# Altium schematic sheet Connection.SchDoc
size 381 x 279 mm; SheetNumber: 1; SheetTotal: 8
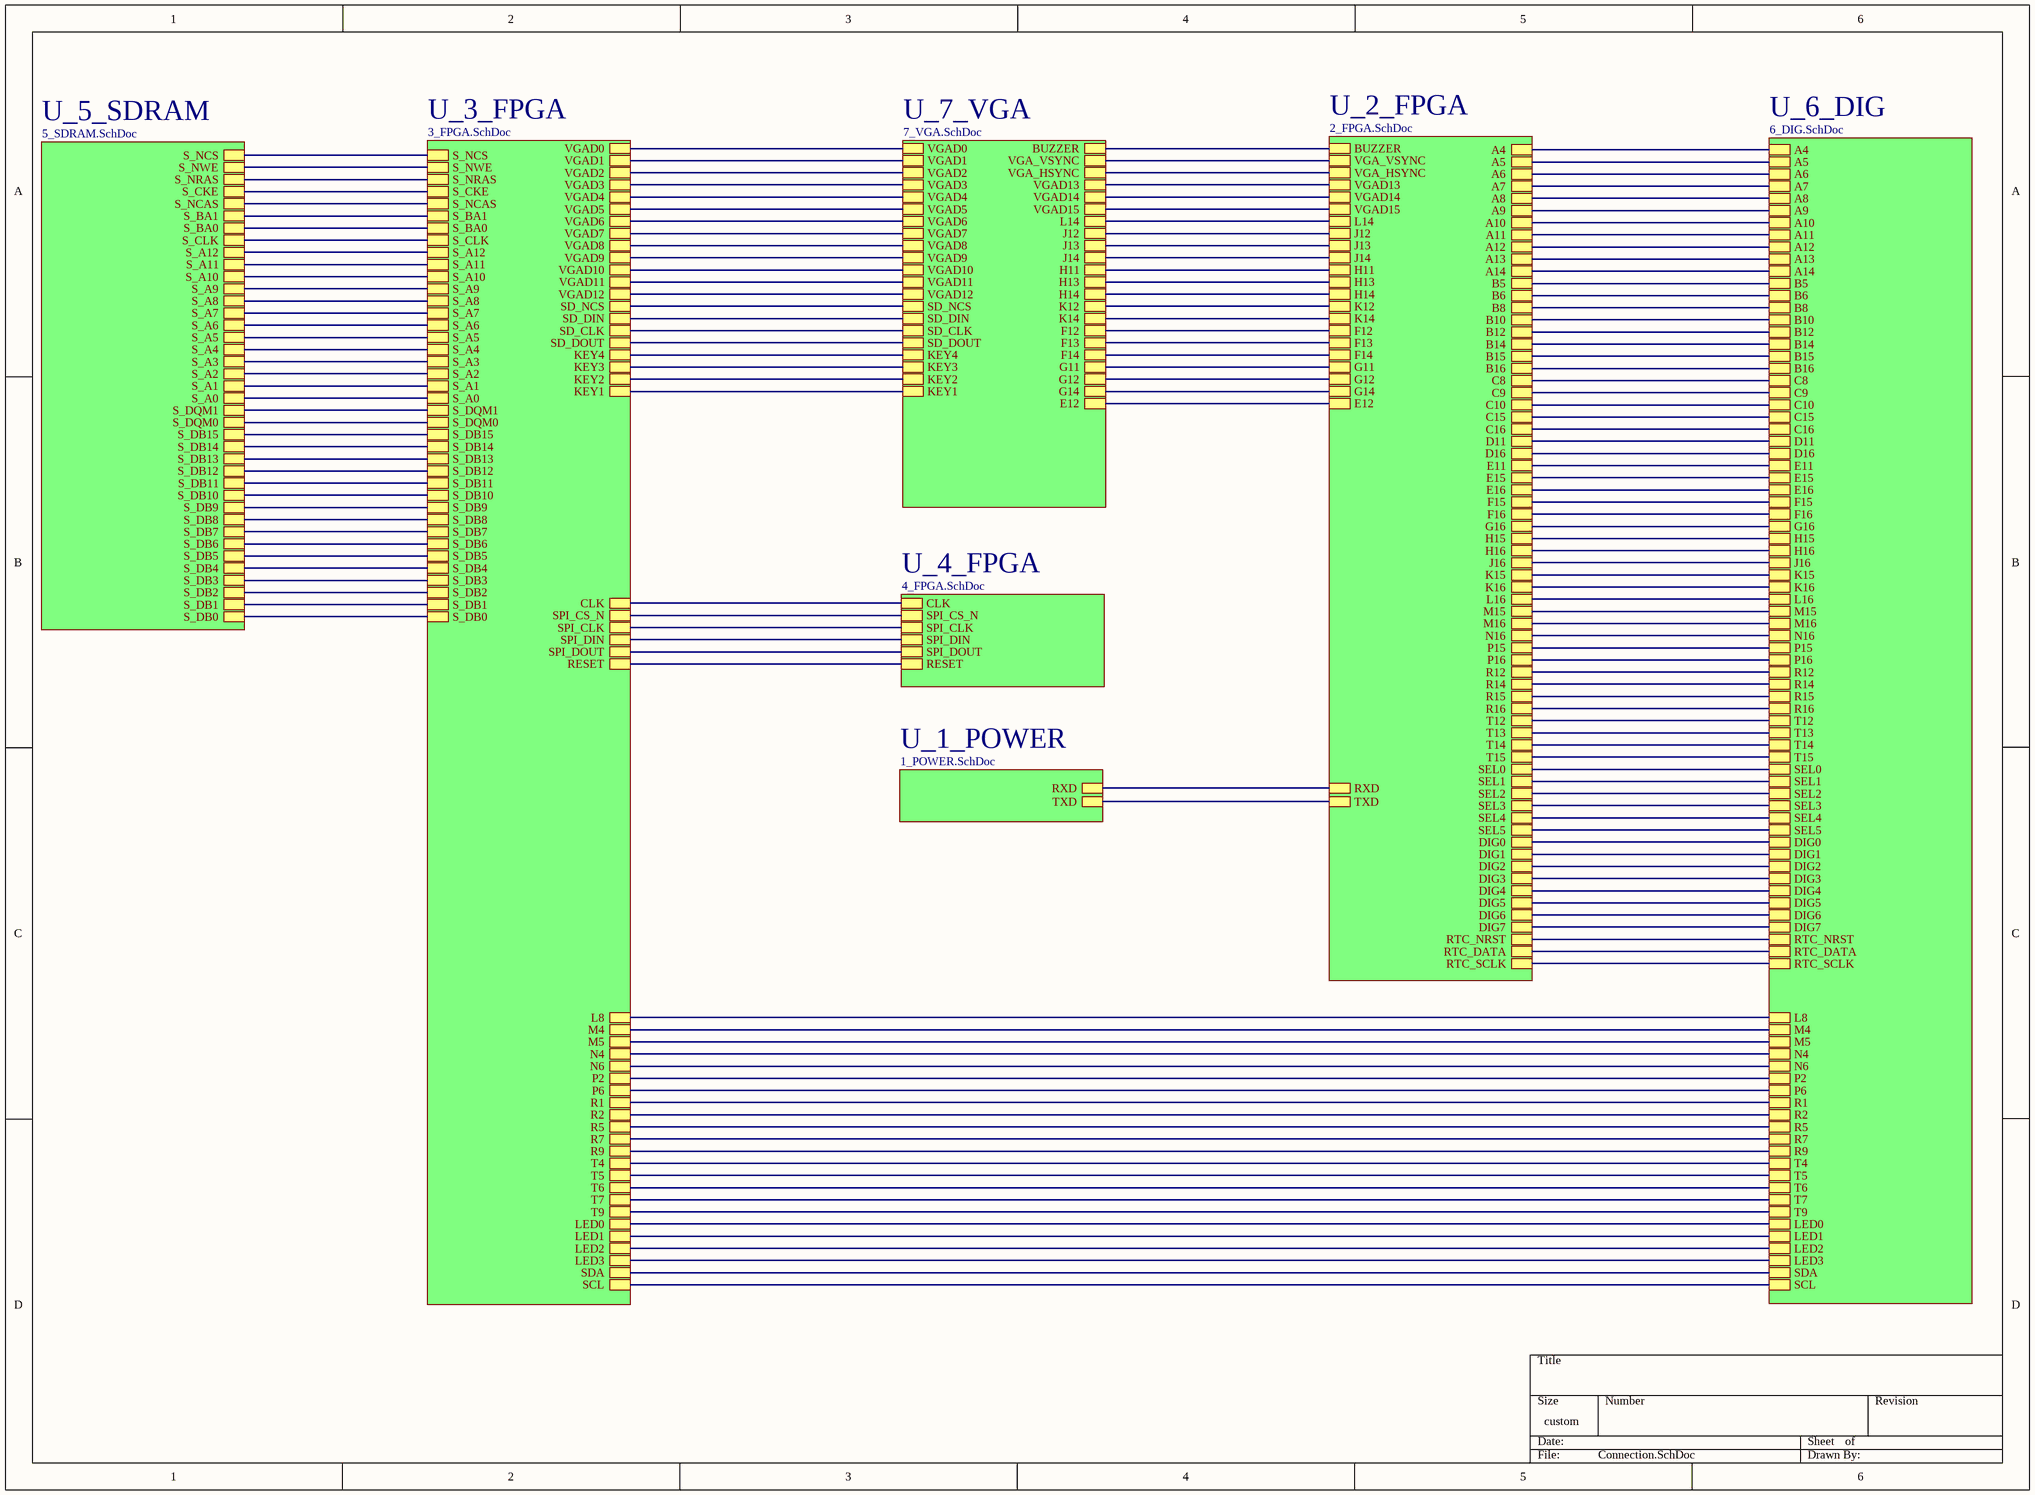
[diagram p0: Connection.SchDoc]

## Sub-sheets
U_1_POWER = 1_POWER.SchDoc: RXD, TXD
U_2_FPGA = 2_FPGA.SchDoc: RTC_SCLK, E12, B15, B16, F12, G11, RTC_DATA, D16, F13, F14, C15, C16, E15, E16, F15, F16, G14, G16, H15, H16, G12, H11, H13, H14, BUZZER, J12, J13, K14, K12, J14, J16, K15, K16, VGAD14, N16, M15, M16, L14, L16, P15, P16, R15, R16, R14, T15, T14, T13, R12, T12, VGAD13, VGA_VSYNC, VGAD15, VGA_HSYNC, A4, B5, A5, DIG6, DIG2, B6, A6, DIG3, DIG1, DIG0, A7, DIG4, DIG7, B8, A8, C9, A9, B10, A10, DIG5, SEL1, SEL4, C10, SEL0, C8, RXD, A11, SEL2, SEL5, B12, A12, RTC_NRST, A13, SEL3, E11, B14, A14, D11, TXD
U_3_FPGA = 3_FPGA.SchDoc: M4, SD_CLK, M5, N4, R2, R1, P2, S_A4, SD_NCS, S_A5, S_A6, S_A7, RESET, S_A8, S_A9, S_A11, S_A0, S_A12, S_CKE, S_DB12, S_DQM1, S_NCS, S_NCAS, S_NRAS, S_A2, S_A1, S_BA1, S_DB8, S_CLK, S_DB10, SD_DOUT, SD_DIN, S_DQM0, S_NWE, S_A3, S_A10, KEY1, S_DB5, KEY2, S_DB7, S_DB6, S_DB4, S_BA0, S_DB9, S_DB3, S_DB2, S_DB15, S_DB14, KEY3, KEY4, S_DB11, S_DB13, S_DB1, S_DB0, VGAD12, VGAD11, SPI_DOUT, SCL, SDA, VGAD10, VGAD6, VGAD7, VGAD8, VGAD9, R9, T9, VGAD5, VGAD3, VGAD2, CLK, VGAD0, VGAD1, R7, T7, P6, T6, R5, T5, LED1, LED2, L8, VGAD4, LED0, T4, LED3, N6, SPI_CS_N, SPI_CLK, SPI_DIN
U_4_FPGA = 4_FPGA.SchDoc: CLK, SPI_CS_N, SPI_CLK, SPI_DIN, SPI_DOUT, RESET
U_5_SDRAM = 5_SDRAM.SchDoc: S_DB0, S_DB1, S_DB2, S_DB3, S_DB4, S_DB5, S_DB6, S_DB7, S_DB8, S_DB9, S_DB10, S_DB11, S_DB12, S_DB13, S_DB14, S_DB15, S_DQM0, S_DQM1, S_A0, S_A1, S_A2, S_A3, S_A4, S_A5, S_A6, S_A7, S_A8, S_A9, S_A10, S_A11, S_A12, S_CLK, S_BA0, S_BA1, S_NCAS, S_CKE, S_NRAS, S_NWE, S_NCS
U_6_DIG = 6_DIG.SchDoc: A4, B5, A5, A6, A7, A8, A9, A10, A11, A12, A13, A14, B6, B8, C8, B10, B12, B14, B15, B16, C15, C16, D16, E15, E16, C9, C10, E11, D11, F15, F16, G16, H15, H16, LED0, LED1, LED2, LED3, SDA, SCL, J16, K16, K15, L16, M16, M15, N16, P16, P15, R14, R15, R16, T12, T13, T14, T15, R12, T4, T5, T6, T7, T9, L8, R9, R7, R5, R1, R2, M4, M5, N4, P6, N6, P2, DIG4, DIG1, DIG2, DIG3, DIG5, DIG6, DIG7, DIG0, SEL0, SEL1, SEL2, SEL3, SEL4, SEL5, RTC_SCLK, RTC_NRST, RTC_DATA
U_7_VGA = 7_VGA.SchDoc: VGAD15, VGAD0, VGAD1, VGAD2, VGAD3, VGAD4, VGAD5, VGAD6, VGAD7, VGAD8, VGAD9, VGAD10, VGAD11, VGAD12, VGAD13, VGAD14, L14, K14, J14, H11, G12, H14, G14, F14, K12, J13, J12, G11, H13, F12, F13, E12, BUZZER, SD_NCS, SD_DIN, SD_CLK, SD_DOUT, KEY4, KEY3, KEY2, KEY1, VGA_HSYNC, VGA_VSYNC

## Nets
(unnamed): sheet U_1_POWER/RXD, sheet U_2_FPGA/RXD
(unnamed): sheet U_1_POWER/TXD, sheet U_2_FPGA/TXD
(unnamed): sheet U_2_FPGA/RTC_SCLK, sheet U_6_DIG/RTC_SCLK
(unnamed): sheet U_2_FPGA/E12, sheet U_7_VGA/E12
(unnamed): sheet U_2_FPGA/B15, sheet U_6_DIG/B15
(unnamed): sheet U_2_FPGA/B16, sheet U_6_DIG/B16
(unnamed): sheet U_2_FPGA/F12, sheet U_7_VGA/F12
(unnamed): sheet U_2_FPGA/G11, sheet U_7_VGA/G11
(unnamed): sheet U_2_FPGA/RTC_DATA, sheet U_6_DIG/RTC_DATA
(unnamed): sheet U_2_FPGA/D16, sheet U_6_DIG/D16
(unnamed): sheet U_2_FPGA/F13, sheet U_7_VGA/F13
(unnamed): sheet U_2_FPGA/F14, sheet U_7_VGA/F14
(unnamed): sheet U_2_FPGA/C15, sheet U_6_DIG/C15
(unnamed): sheet U_2_FPGA/C16, sheet U_6_DIG/C16
(unnamed): sheet U_2_FPGA/E15, sheet U_6_DIG/E15
(unnamed): sheet U_2_FPGA/E16, sheet U_6_DIG/E16
(unnamed): sheet U_2_FPGA/F15, sheet U_6_DIG/F15
(unnamed): sheet U_2_FPGA/F16, sheet U_6_DIG/F16
(unnamed): sheet U_2_FPGA/G14, sheet U_7_VGA/G14
(unnamed): sheet U_2_FPGA/G16, sheet U_6_DIG/G16
(unnamed): sheet U_2_FPGA/H15, sheet U_6_DIG/H15
(unnamed): sheet U_2_FPGA/H16, sheet U_6_DIG/H16
(unnamed): sheet U_2_FPGA/G12, sheet U_7_VGA/G12
(unnamed): sheet U_2_FPGA/H11, sheet U_7_VGA/H11
(unnamed): sheet U_2_FPGA/H13, sheet U_7_VGA/H13
(unnamed): sheet U_2_FPGA/H14, sheet U_7_VGA/H14
(unnamed): sheet U_2_FPGA/BUZZER, sheet U_7_VGA/BUZZER
(unnamed): sheet U_2_FPGA/J12, sheet U_7_VGA/J12
(unnamed): sheet U_2_FPGA/J13, sheet U_7_VGA/J13
(unnamed): sheet U_2_FPGA/K14, sheet U_7_VGA/K14
(unnamed): sheet U_2_FPGA/K12, sheet U_7_VGA/K12
(unnamed): sheet U_2_FPGA/J14, sheet U_7_VGA/J14
(unnamed): sheet U_2_FPGA/J16, sheet U_6_DIG/J16
(unnamed): sheet U_2_FPGA/K15, sheet U_6_DIG/K15
(unnamed): sheet U_2_FPGA/K16, sheet U_6_DIG/K16
(unnamed): sheet U_2_FPGA/VGAD14, sheet U_7_VGA/VGAD14
(unnamed): sheet U_2_FPGA/N16, sheet U_6_DIG/N16
(unnamed): sheet U_2_FPGA/M15, sheet U_6_DIG/M15
(unnamed): sheet U_2_FPGA/M16, sheet U_6_DIG/M16
(unnamed): sheet U_2_FPGA/L14, sheet U_7_VGA/L14
(unnamed): sheet U_2_FPGA/L16, sheet U_6_DIG/L16
(unnamed): sheet U_2_FPGA/P15, sheet U_6_DIG/P15
(unnamed): sheet U_2_FPGA/P16, sheet U_6_DIG/P16
(unnamed): sheet U_2_FPGA/R15, sheet U_6_DIG/R15
(unnamed): sheet U_2_FPGA/R16, sheet U_6_DIG/R16
(unnamed): sheet U_2_FPGA/R14, sheet U_6_DIG/R14
(unnamed): sheet U_2_FPGA/T15, sheet U_6_DIG/T15
(unnamed): sheet U_2_FPGA/T14, sheet U_6_DIG/T14
(unnamed): sheet U_2_FPGA/T13, sheet U_6_DIG/T13
(unnamed): sheet U_2_FPGA/R12, sheet U_6_DIG/R12
(unnamed): sheet U_2_FPGA/T12, sheet U_6_DIG/T12
(unnamed): sheet U_2_FPGA/VGAD13, sheet U_7_VGA/VGAD13
(unnamed): sheet U_2_FPGA/VGA_VSYNC, sheet U_7_VGA/VGA_VSYNC
(unnamed): sheet U_2_FPGA/VGAD15, sheet U_7_VGA/VGAD15
(unnamed): sheet U_2_FPGA/VGA_HSYNC, sheet U_7_VGA/VGA_HSYNC
(unnamed): sheet U_2_FPGA/A4, sheet U_6_DIG/A4
(unnamed): sheet U_2_FPGA/B5, sheet U_6_DIG/B5
(unnamed): sheet U_2_FPGA/A5, sheet U_6_DIG/A5
(unnamed): sheet U_2_FPGA/DIG6, sheet U_6_DIG/DIG6
(unnamed): sheet U_2_FPGA/DIG2, sheet U_6_DIG/DIG2
(unnamed): sheet U_2_FPGA/B6, sheet U_6_DIG/B6
(unnamed): sheet U_2_FPGA/A6, sheet U_6_DIG/A6
(unnamed): sheet U_2_FPGA/DIG3, sheet U_6_DIG/DIG3
(unnamed): sheet U_2_FPGA/DIG1, sheet U_6_DIG/DIG1
(unnamed): sheet U_2_FPGA/DIG0, sheet U_6_DIG/DIG0
(unnamed): sheet U_2_FPGA/A7, sheet U_6_DIG/A7
(unnamed): sheet U_2_FPGA/DIG4, sheet U_6_DIG/DIG4
(unnamed): sheet U_2_FPGA/DIG7, sheet U_6_DIG/DIG7
(unnamed): sheet U_2_FPGA/B8, sheet U_6_DIG/B8
(unnamed): sheet U_2_FPGA/A8, sheet U_6_DIG/A8
(unnamed): sheet U_2_FPGA/C9, sheet U_6_DIG/C9
(unnamed): sheet U_2_FPGA/A9, sheet U_6_DIG/A9
(unnamed): sheet U_2_FPGA/B10, sheet U_6_DIG/B10
(unnamed): sheet U_2_FPGA/A10, sheet U_6_DIG/A10
(unnamed): sheet U_2_FPGA/DIG5, sheet U_6_DIG/DIG5
(unnamed): sheet U_2_FPGA/SEL1, sheet U_6_DIG/SEL1
(unnamed): sheet U_2_FPGA/SEL4, sheet U_6_DIG/SEL4
(unnamed): sheet U_2_FPGA/C10, sheet U_6_DIG/C10
(unnamed): sheet U_2_FPGA/SEL0, sheet U_6_DIG/SEL0
(unnamed): sheet U_2_FPGA/C8, sheet U_6_DIG/C8
(unnamed): sheet U_2_FPGA/A11, sheet U_6_DIG/A11
(unnamed): sheet U_2_FPGA/SEL2, sheet U_6_DIG/SEL2
(unnamed): sheet U_2_FPGA/SEL5, sheet U_6_DIG/SEL5
(unnamed): sheet U_2_FPGA/B12, sheet U_6_DIG/B12
(unnamed): sheet U_2_FPGA/A12, sheet U_6_DIG/A12
(unnamed): sheet U_2_FPGA/RTC_NRST, sheet U_6_DIG/RTC_NRST
(unnamed): sheet U_2_FPGA/A13, sheet U_6_DIG/A13
(unnamed): sheet U_2_FPGA/SEL3, sheet U_6_DIG/SEL3
(unnamed): sheet U_2_FPGA/E11, sheet U_6_DIG/E11
(unnamed): sheet U_2_FPGA/B14, sheet U_6_DIG/B14
(unnamed): sheet U_2_FPGA/A14, sheet U_6_DIG/A14
(unnamed): sheet U_2_FPGA/D11, sheet U_6_DIG/D11
(unnamed): sheet U_3_FPGA/M4, sheet U_6_DIG/M4
(unnamed): sheet U_3_FPGA/SD_CLK, sheet U_7_VGA/SD_CLK
(unnamed): sheet U_3_FPGA/M5, sheet U_6_DIG/M5
(unnamed): sheet U_3_FPGA/N4, sheet U_6_DIG/N4
(unnamed): sheet U_3_FPGA/R2, sheet U_6_DIG/R2
(unnamed): sheet U_3_FPGA/R1, sheet U_6_DIG/R1
(unnamed): sheet U_3_FPGA/P2, sheet U_6_DIG/P2
(unnamed): sheet U_3_FPGA/S_A4, sheet U_5_SDRAM/S_A4
(unnamed): sheet U_3_FPGA/SD_NCS, sheet U_7_VGA/SD_NCS
(unnamed): sheet U_3_FPGA/S_A5, sheet U_5_SDRAM/S_A5
(unnamed): sheet U_3_FPGA/S_A6, sheet U_5_SDRAM/S_A6
(unnamed): sheet U_3_FPGA/S_A7, sheet U_5_SDRAM/S_A7
(unnamed): sheet U_3_FPGA/RESET, sheet U_4_FPGA/RESET
(unnamed): sheet U_3_FPGA/S_A8, sheet U_5_SDRAM/S_A8
(unnamed): sheet U_3_FPGA/S_A9, sheet U_5_SDRAM/S_A9
(unnamed): sheet U_3_FPGA/S_A11, sheet U_5_SDRAM/S_A11
(unnamed): sheet U_3_FPGA/S_A0, sheet U_5_SDRAM/S_A0
(unnamed): sheet U_3_FPGA/S_A12, sheet U_5_SDRAM/S_A12
(unnamed): sheet U_3_FPGA/S_CKE, sheet U_5_SDRAM/S_CKE
(unnamed): sheet U_3_FPGA/S_DB12, sheet U_5_SDRAM/S_DB12
(unnamed): sheet U_3_FPGA/S_DQM1, sheet U_5_SDRAM/S_DQM1
(unnamed): sheet U_3_FPGA/S_NCS, sheet U_5_SDRAM/S_NCS
(unnamed): sheet U_3_FPGA/S_NCAS, sheet U_5_SDRAM/S_NCAS
(unnamed): sheet U_3_FPGA/S_NRAS, sheet U_5_SDRAM/S_NRAS
(unnamed): sheet U_3_FPGA/S_A2, sheet U_5_SDRAM/S_A2
(unnamed): sheet U_3_FPGA/S_A1, sheet U_5_SDRAM/S_A1
(unnamed): sheet U_3_FPGA/S_BA1, sheet U_5_SDRAM/S_BA1
(unnamed): sheet U_3_FPGA/S_DB8, sheet U_5_SDRAM/S_DB8
(unnamed): sheet U_3_FPGA/S_CLK, sheet U_5_SDRAM/S_CLK
(unnamed): sheet U_3_FPGA/S_DB10, sheet U_5_SDRAM/S_DB10
(unnamed): sheet U_3_FPGA/SD_DOUT, sheet U_7_VGA/SD_DOUT
(unnamed): sheet U_3_FPGA/SD_DIN, sheet U_7_VGA/SD_DIN
(unnamed): sheet U_3_FPGA/S_DQM0, sheet U_5_SDRAM/S_DQM0
(unnamed): sheet U_3_FPGA/S_NWE, sheet U_5_SDRAM/S_NWE
(unnamed): sheet U_3_FPGA/S_A3, sheet U_5_SDRAM/S_A3
(unnamed): sheet U_3_FPGA/S_A10, sheet U_5_SDRAM/S_A10
(unnamed): sheet U_3_FPGA/KEY1, sheet U_7_VGA/KEY1
(unnamed): sheet U_3_FPGA/S_DB5, sheet U_5_SDRAM/S_DB5
(unnamed): sheet U_3_FPGA/KEY2, sheet U_7_VGA/KEY2
(unnamed): sheet U_3_FPGA/S_DB7, sheet U_5_SDRAM/S_DB7
(unnamed): sheet U_3_FPGA/S_DB6, sheet U_5_SDRAM/S_DB6
(unnamed): sheet U_3_FPGA/S_DB4, sheet U_5_SDRAM/S_DB4
(unnamed): sheet U_3_FPGA/S_BA0, sheet U_5_SDRAM/S_BA0
(unnamed): sheet U_3_FPGA/S_DB9, sheet U_5_SDRAM/S_DB9
(unnamed): sheet U_3_FPGA/S_DB3, sheet U_5_SDRAM/S_DB3
(unnamed): sheet U_3_FPGA/S_DB2, sheet U_5_SDRAM/S_DB2
(unnamed): sheet U_3_FPGA/S_DB15, sheet U_5_SDRAM/S_DB15
(unnamed): sheet U_3_FPGA/S_DB14, sheet U_5_SDRAM/S_DB14
(unnamed): sheet U_3_FPGA/KEY3, sheet U_7_VGA/KEY3
(unnamed): sheet U_3_FPGA/KEY4, sheet U_7_VGA/KEY4
(unnamed): sheet U_3_FPGA/S_DB11, sheet U_5_SDRAM/S_DB11
(unnamed): sheet U_3_FPGA/S_DB13, sheet U_5_SDRAM/S_DB13
(unnamed): sheet U_3_FPGA/S_DB1, sheet U_5_SDRAM/S_DB1
(unnamed): sheet U_3_FPGA/S_DB0, sheet U_5_SDRAM/S_DB0
(unnamed): sheet U_3_FPGA/VGAD12, sheet U_7_VGA/VGAD12
(unnamed): sheet U_3_FPGA/VGAD11, sheet U_7_VGA/VGAD11
(unnamed): sheet U_3_FPGA/SPI_DOUT, sheet U_4_FPGA/SPI_DOUT
(unnamed): sheet U_3_FPGA/SCL, sheet U_6_DIG/SCL
(unnamed): sheet U_3_FPGA/SDA, sheet U_6_DIG/SDA
(unnamed): sheet U_3_FPGA/VGAD10, sheet U_7_VGA/VGAD10
(unnamed): sheet U_3_FPGA/VGAD6, sheet U_7_VGA/VGAD6
(unnamed): sheet U_3_FPGA/VGAD7, sheet U_7_VGA/VGAD7
(unnamed): sheet U_3_FPGA/VGAD8, sheet U_7_VGA/VGAD8
(unnamed): sheet U_3_FPGA/VGAD9, sheet U_7_VGA/VGAD9
(unnamed): sheet U_3_FPGA/R9, sheet U_6_DIG/R9
(unnamed): sheet U_3_FPGA/T9, sheet U_6_DIG/T9
(unnamed): sheet U_3_FPGA/VGAD5, sheet U_7_VGA/VGAD5
(unnamed): sheet U_3_FPGA/VGAD3, sheet U_7_VGA/VGAD3
(unnamed): sheet U_3_FPGA/VGAD2, sheet U_7_VGA/VGAD2
(unnamed): sheet U_3_FPGA/CLK, sheet U_4_FPGA/CLK
(unnamed): sheet U_3_FPGA/VGAD0, sheet U_7_VGA/VGAD0
(unnamed): sheet U_3_FPGA/VGAD1, sheet U_7_VGA/VGAD1
(unnamed): sheet U_3_FPGA/R7, sheet U_6_DIG/R7
(unnamed): sheet U_3_FPGA/T7, sheet U_6_DIG/T7
(unnamed): sheet U_3_FPGA/P6, sheet U_6_DIG/P6
(unnamed): sheet U_3_FPGA/T6, sheet U_6_DIG/T6
(unnamed): sheet U_3_FPGA/R5, sheet U_6_DIG/R5
(unnamed): sheet U_3_FPGA/T5, sheet U_6_DIG/T5
(unnamed): sheet U_3_FPGA/LED1, sheet U_6_DIG/LED1
(unnamed): sheet U_3_FPGA/LED2, sheet U_6_DIG/LED2
(unnamed): sheet U_3_FPGA/L8, sheet U_6_DIG/L8
(unnamed): sheet U_3_FPGA/VGAD4, sheet U_7_VGA/VGAD4
(unnamed): sheet U_3_FPGA/LED0, sheet U_6_DIG/LED0
(unnamed): sheet U_3_FPGA/T4, sheet U_6_DIG/T4
(unnamed): sheet U_3_FPGA/LED3, sheet U_6_DIG/LED3
(unnamed): sheet U_3_FPGA/N6, sheet U_6_DIG/N6
(unnamed): sheet U_3_FPGA/SPI_CS_N, sheet U_4_FPGA/SPI_CS_N
(unnamed): sheet U_3_FPGA/SPI_CLK, sheet U_4_FPGA/SPI_CLK
(unnamed): sheet U_3_FPGA/SPI_DIN, sheet U_4_FPGA/SPI_DIN